# EAGLE design Celsius-Temperature-Sensor (EAGLE 7.4.0)
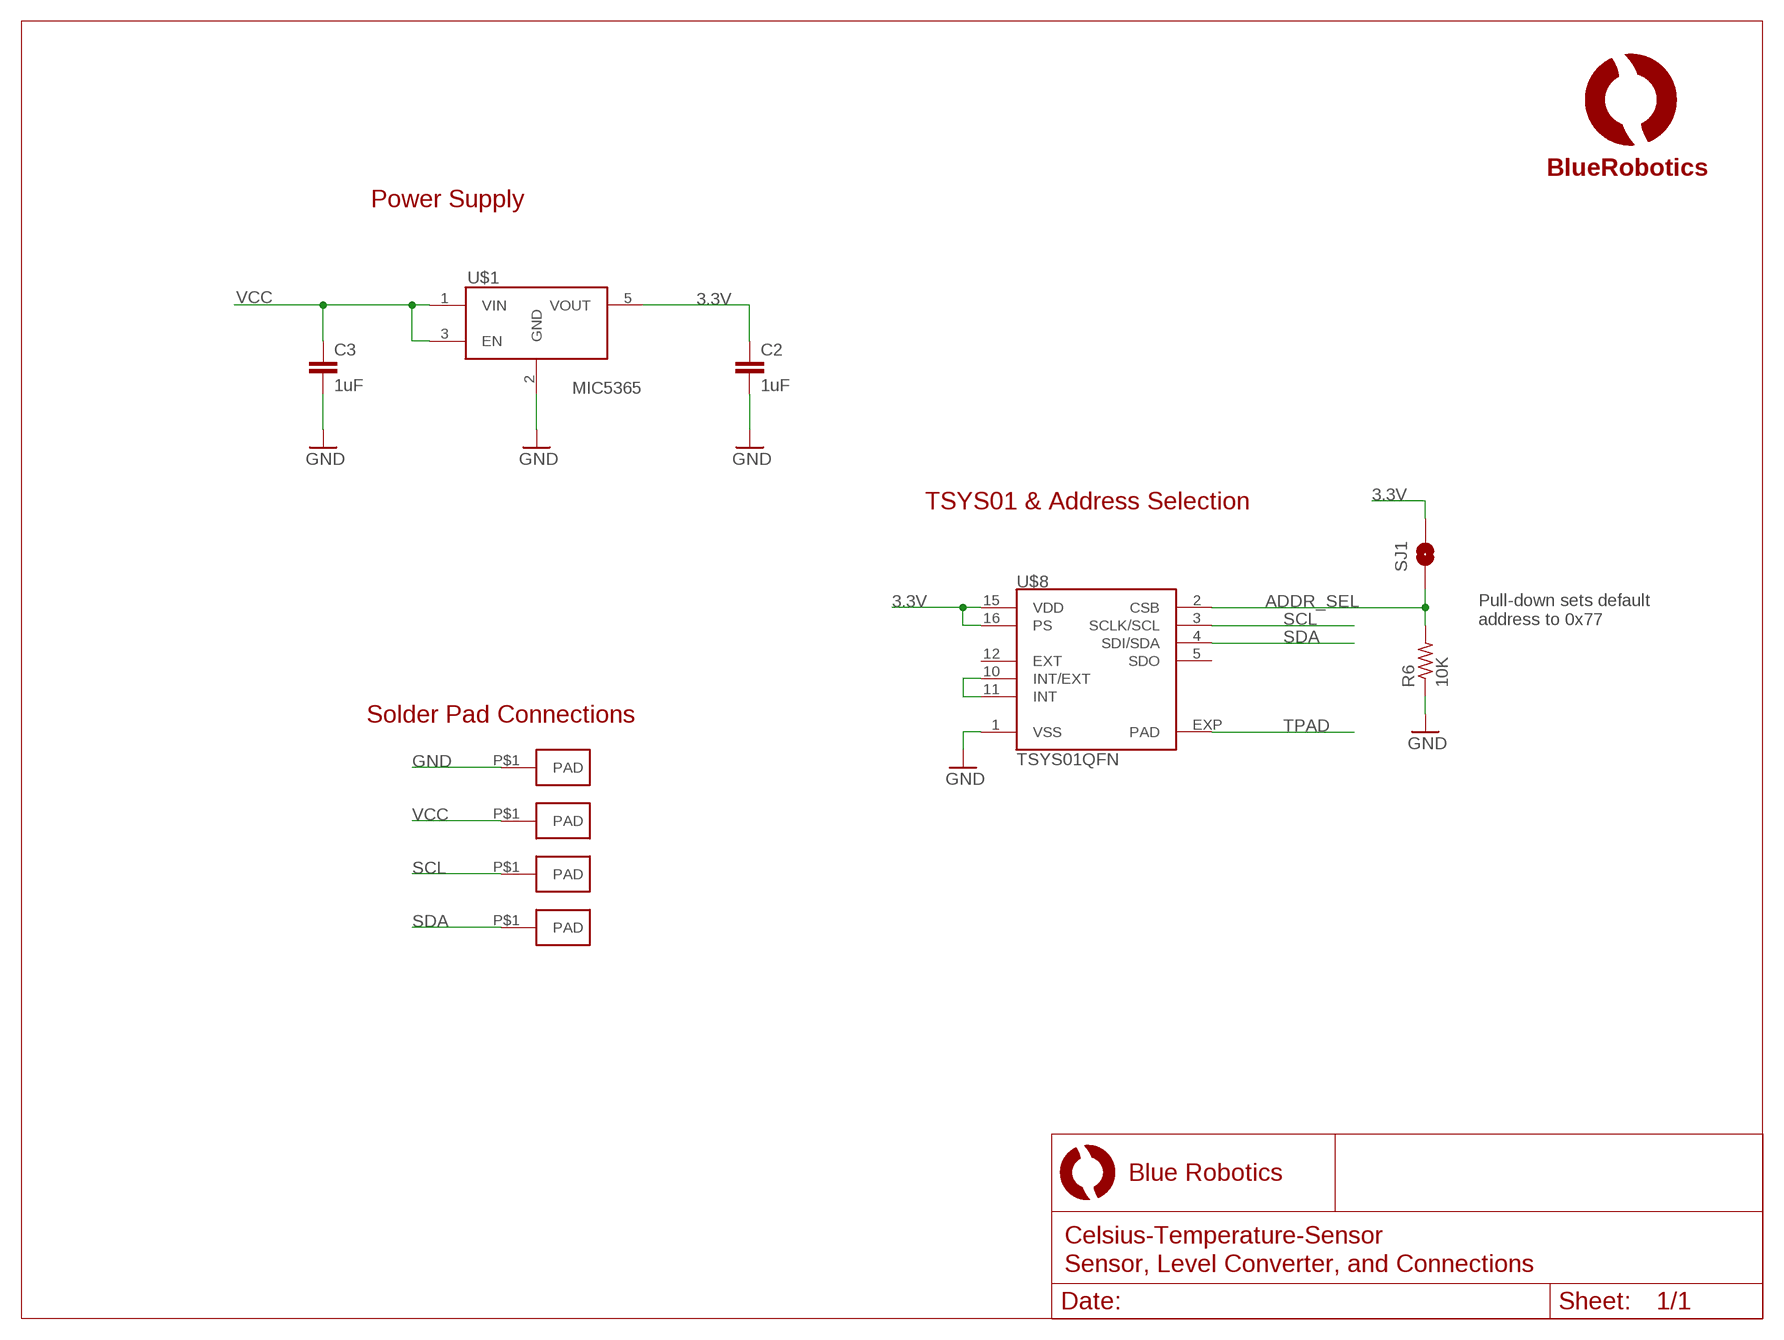
[diagram p0: schematic, sheet 1]

## Parts
C2  1uF  C-EUC0402  [C0402]
C3  1uF  C-EUC0402  [C0402]
R6  10K  R-US_R0402  [R0402]
SJ1  JUMPER-PAD-2-NO  [PAD-JUMPER-2-NO_NO_SILK]
U$1  VREG-MIC5365  [SC70-5L]
U$3  PAD1.5X3MM  [PAD-1.5X3MM]
U$4  PAD1.5X3MM  [PAD-1.5X3MM]
U$5  PAD1.5X3MM  [PAD-1.5X3MM]
U$6  PAD1.5X3MM  [PAD-1.5X3MM]
U$7  LOGOBR-LOGO-S  [BR-LOGO-SMALL]
U$8  TSYS01QFN  [QFN16-4X4]

## Nets
3.3V: C2.1 SJ1.2 U$1.5(VOUT) U$8.15(VDD) U$8.16(PS)
ADDR_SEL: R6.2 SJ1.1 U$8.2(CSB)
GND: C2.2 C3.2 R6.1 U$1.2(GND) U$3.P$1(PAD) U$8.1(VSS)
N$1: U$8.10(INT/EXT) U$8.11(INT)
SCL: U$5.P$1(PAD) U$8.3(SCLK/SCL)
SDA: U$6.P$1(PAD) U$8.4(SDI/SDA)
TPAD: U$8.EXP(PAD)
VCC: C3.1 U$1.1(VIN) U$1.3(EN) U$4.P$1(PAD)
Unconnected: U$8.5(SDO) U$8.12(EXT)

## Notes on the sheet
- Power Supply
- MIC5365
- TSYS01 & Address Selection
- Pull-down sets default
  address to 0x77
- Solder Pad Connections

## Library data of the parts
C2 C3 = resistor:C-EU: CAPACITOR, European symbol
R6 = resistor:R-US_: RESISTOR, American symbol
SJ1 = SparkFun-Passives:JUMPER-PAD-2-NO
U$1 = BlueRobotics-Main:VREG-MIC5365
U$3-U$6 = BR-Eagle-Library:PAD
U$7 = BR-Eagle-Library:LOGO
U$8 = BR-Eagle-Library:TSYS01

## Board
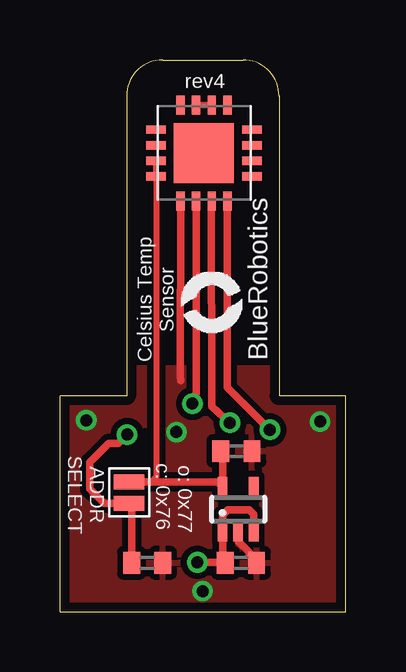
[diagram p1: board, top side]
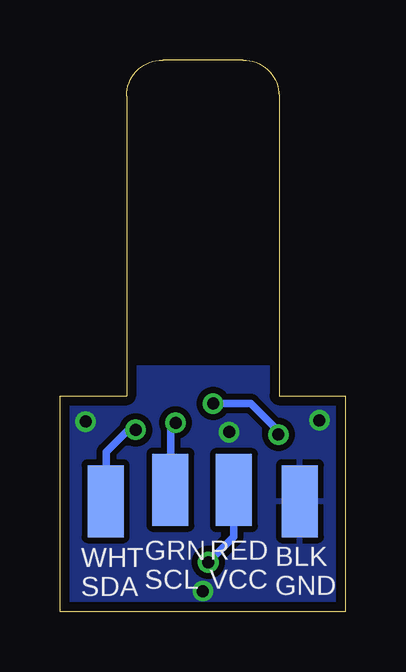
[diagram p2: board, bottom side, seen from below]

Size 11.9 x 23 mm. Coordinates in mm from the lower left corner, seen from the top.
Outline: 0,0 0,9 2.77,9 2.77,21.5 arc-90 4.27,23 7.62,23 arc-90 9.12,21.5 9.12,9 11.9,9 11.9,0 0,0
Copper layers (1*16): Top 0.0356mm / dielectric 1.5011mm / Bottom 0.0356mm
Design rules "OSHPark": minimum track width 6mil, minimum drill 13mil, track to track 6mil, track to pad 6mil, pad to pad 6mil, via to via 6mil, smd to smd 6mil, copper to edge 15mil, drill to drill 6mil, minimum pad ring 7mil, minimum via ring 7mil, stop-mask expansion 3mil, vias tented up to drill 0mil, thermal gap 10mil

### Footprints (pad centres in the part's own frame; a part is rotated, then mirrored left to right if it is on the bottom)
C0402 = smd 0.7 x 0.9: 1 -0.65,0; 2 0.65,0
R0402 = smd 0.7 x 0.9: 1 -0.65,0; 2 0.65,0
PAD-JUMPER-2-NO_NO_SILK = smd 0.635 x 1.27: 1 -0.45,0; 2 0.45,0
SC70-5L = smd 0.4 x 0.8: 1 -0.65,-0.95; 2 0,-0.95; 3 0.65,-0.95; 4 0.65,0.95; 5 -0.65,0.95
PAD-1.5X3MM = smd 3 x 1.5: P$1 0,0
QFN16-4X4 = smd 0.8 x 0.35: 1 -2,0.975; 2 -2,0.325; 3 -2,-0.325; 4 -2,-0.975; 9 2,-0.975; 10 2,-0.325; 11 2,0.325; 12 2,0.975 | smd 0.35 x 0.8: 5 -0.975,-2; 6 -0.325,-2; 7 0.325,-2; 8 0.975,-2; 13 0.975,2; 14 0.325,2; 15 -0.325,2; 16 -0.975,2 | smd 2.5 x 2.5: EXP 0,0

### Placement (x,y rotation side)
C2  7.35,6.69 0 top
C3  7.54,2.03 0 top
R6  3.63,2.03 180 top
SJ1  2.88,4.96 90 top
U$1  7.42,4.27 0 top
U$3  1.9,4.6 270 bottom
U$4  4.66,5.06 90 bottom
U$5  7.3,5.08 270 bottom
U$6  10,4.6 270 bottom
U$7  7.57,11.64 90 top
U$8  6,19.12 90 top

### Tracks (layer width: path | path; a pad name or v marks a point on that pad's centre or on a via)
3.3V
  Top 0.254: U$8.15 U$8.16 4.01,5.61 3.81,5.41
  Top 0.305: C2.1 6.77,6.62 U$1.5 6.58,5.41 3.81,5.41 SJ1.2
ADDR_SEL  (via drill 0.5)
  Top 0.305: R6.2 2.98,4.41 SJ1.1 1.85,4.51 1.24,5.12 1.24,6.23 2.03,7.02 2.44,7.02 v2.8,7.38 | v5.52,8.68 5.36,8.75 5.67,9.07 U$8.2
  Bottom 0.305: v2.8,7.38 2.8,7.52 3.95,8.67 5.35,8.67 v5.52,8.68
GND  (via drill 0.5)
  Top 0.305: U$1.2 7.42,2.93 7.89,2.47 7.89,2.33 C3.2 | U$8.1 5.02,9.8 5.03,9.63
  other vias: 1.09,7.97 4.85,7.48 10.83,7.92 5.94,0.85
  pour Bottom (isolate 0.254): 0,0 13.97,0 13.97,10.16 0,10.16
  pour Top (isolate 0.254): -1.27,10.16 12.7,10.16 12.7,0 -1.27,0
N$1
  Top 0.254: U$8.10 U$8.11
SCL  (via drill 0.5)
  Top 0.254: 6.29,17.09 U$8.3
  Top 0.305: 6.29,17.09 6.31,8.55 v7.08,7.87
  Bottom 0.305: U$5.P$1 7.29,7.66 v7.08,7.87
SDA  (via drill 0.5)
  Top 0.254: 6.99,17.1 U$8.4
  Top 0.305: U$8.4 6.97,9.34 v8.75,7.57
  Bottom 0.305: v8.75,7.57 9.06,7.57 9.98,6.65 9.98,4.62 U$6.P$1
TPAD
  Top 0.254: 5.39,19.71 5.41,19.71 U$8.EXP | 5.39,18.51 U$8.EXP | 6.57,19.71 6.57,19.69 U$8.EXP
VCC  (via drill 0.5)
  Top 0.305: v5.72,2.05 6.87,2.05 C3.1 6.77,2.15 U$1.1 6.77,4.03 6.99,4.25 7.88,4.25 8.07,4.06 U$1.3
  Bottom 0.305: U$4.P$1 4.66,3.11 v5.72,2.05

### Text on the board
tPlace: rev4 | BlueRobotics | Celsius Temp / Sensor | ADDR / SELECT | o: 0x77 / c: 0x76
bPlace: BLK / GND | RED / VCC | GRN / SCL | WHT / SDA